# Altium schematic sheet byggern-schematic.SchDoc
size A3
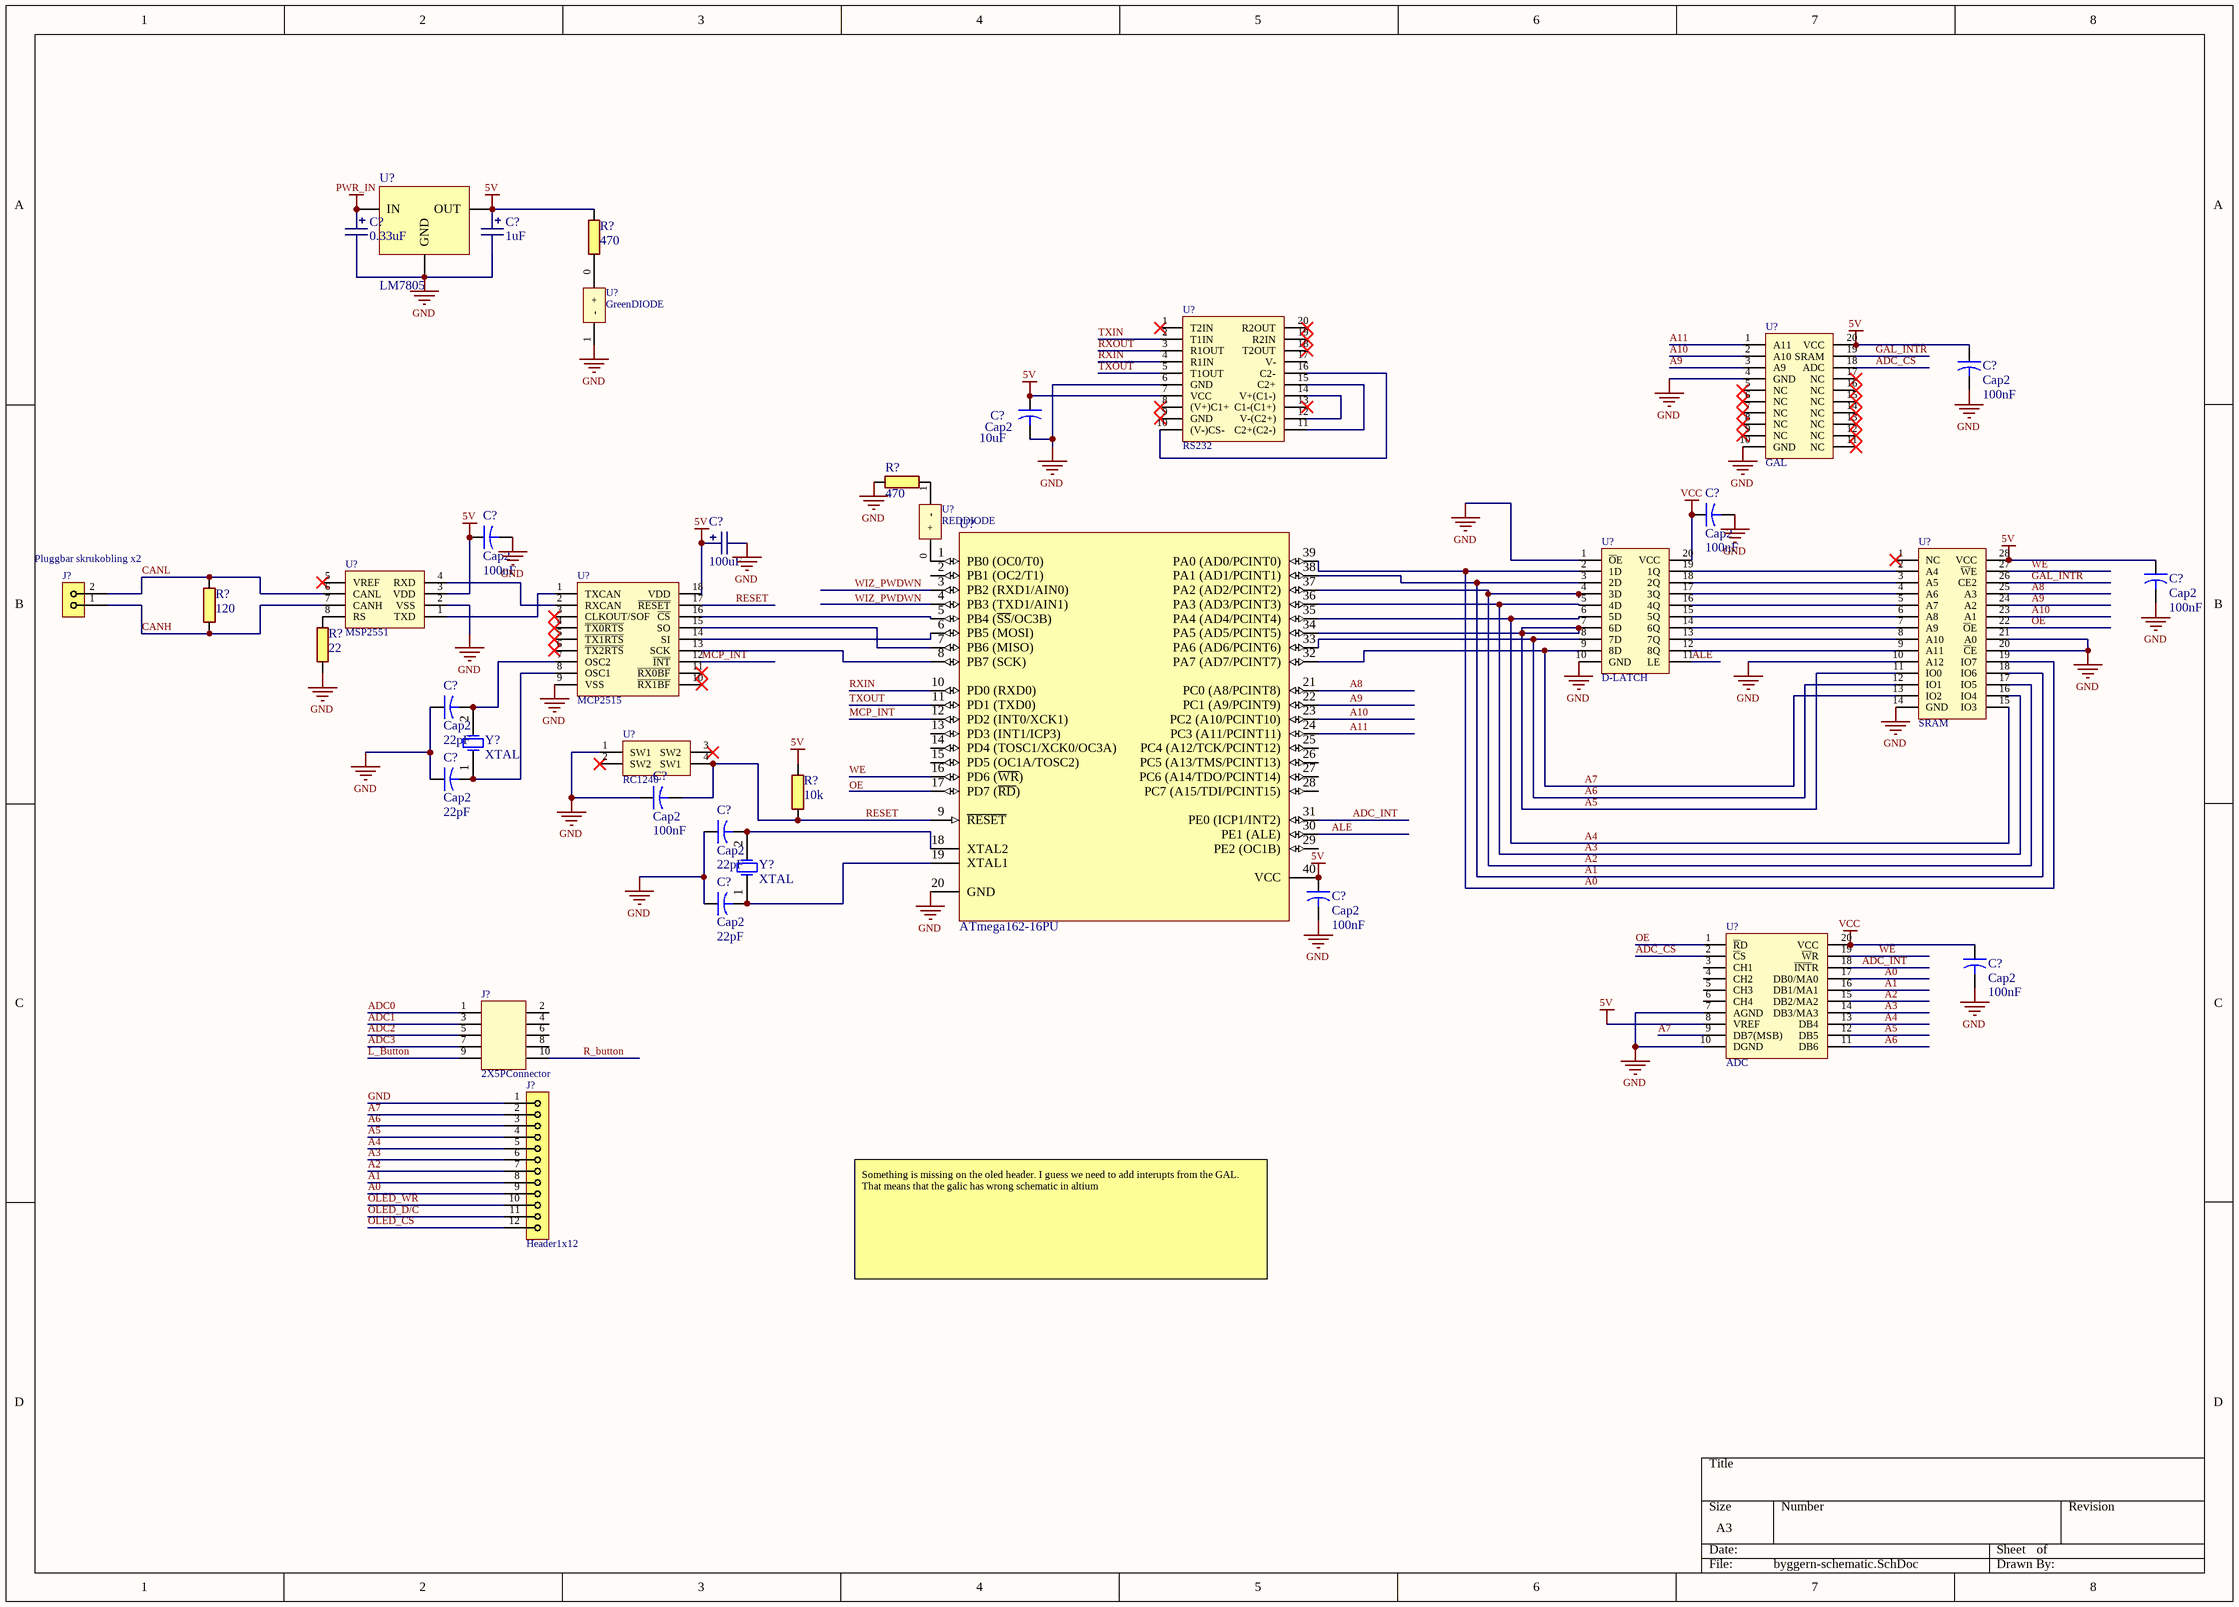
[diagram p0: byggern-schematic.SchDoc]

## Parts
(Parts that share a designator on the sheet are numbered #1, #2 ... from top to bottom, then left to right.)
C?#1  0.33uF  [CAPPR35D08H11]
C?#2  1uF  [CAPPR35D08H11]
C?#3  Cap2  value 100nF  [CAPR5-4X5]
C?#4  Cap2  value 10uF  [CAPR5-4X5]
C?#5  Cap2  value 100nF  [CAPR5-4X5]
C?#6  Cap2  value 100nF  [CAPR5-4X5]
C?#7  100uF  [CAPPR35D08H11]
C?#8  Cap2  value 100nF  [CAPR5-4X5]
C?#9  Cap2  value 22pF  [CAPR5-4X5]
C?#10  Cap2  value 22pF  [CAPR5-4X5]
C?#11  Cap2  value 100nF  [CAPR5-4X5]
C?#12  Cap2  value 22pF  [CAPR5-4X5]
C?#13  Cap2  value 22pF  [CAPR5-4X5]
C?#14  Cap2  value 100nF  [CAPR5-4X5]
C?#15  Cap2  value 100nF  [CAPR5-4X5]
J?#1  Pluggbar skrukobling x2  [FCI-20020110-C021A01LF]
J?#2  2X5PConnector  [HDRV10W64P254_2X5_2030X900X900B]
J?#3  Header1x12  [HDRV12W64P254_1X12_3048X254X900B]
R?#1  470  [RESA_0.25W]
R?#2  470  [RESA_0.25W]
R?#3  120  [RESA_0.25W]
R?#4  22  [RESA_0.25W]
R?#5  10k  [RESA_0.25W]
U?#1  LM7805  [TO-220-3P]
U?#2  GreenDIODE  [LGA30S127P7X81270X2540X350]
U?#3  RS232  [DIP20]
U?#4  GAL  [DIP20]
U?#5  REDDIODE  [LGA30S127P7X81270X2540X350]
U?#6  ATmega162-16PU  [40P6]
U?#7  MSP2551  [DIP8]
U?#8  D-LATCH  [DIP20]
U?#9  MCP2515  [DIP18]
U?#10  SRAM  [DIP28]
U?#11  RC1240  [LGA30S127P7X81270X2540X350]
U?#12  ADC  [DIP20]
Y?#1  XTAL  [R38]
Y?#2  XTAL  [R38]

## Nets
2: U?#1.4
5V: C?#2.2 C?#3.1 C?#4.1 C?#6.1 C?#7.2 C?#8.1 C?#14.1 R?#1.2 R?#5.2 U?#1.3(OUT) U?#3.7(VCC) U?#4.20(VCC) U?#6.40(VCC) U?#7.3(VDD) U?#9.18(VDD) U?#10.28(VCC) U?#12.8(VREF)
GND: C?#1.1 C?#2.1 C?#3.2 C?#4.2 C?#5.2 C?#6.2 C?#7.1 C?#8.2 C?#9.1 C?#10.1 C?#11.1 C?#12.1 C?#13.1 C?#14.2 C?#15.2 J?#3.1 R?#2.2 R?#4.1 U?#1.2(GND) U?#2.1(-) U?#3.6(GND) U?#4.4(GND) U?#4.10(GND) U?#6.20(GND) U?#7.2(VSS) U?#8.1(~{O}E) U?#8.10(GND) U?#9.9(VSS) U?#10.10(A12) U?#10.14(GND) U?#10.20(~{C}E) U?#10.21(A0) U?#11.1(SW1) U?#12.7(AGND) U?#12.10(DGND)
PWR_IN: C?#1.2 U?#1.1(IN)
VCC: C?#5.1 C?#15.1 U?#8.20(VCC) U?#12.20(VCC)
A0: J?#3.9 U?#6.39(PA0_(AD0/PCINT0)) U?#8.2(1D) U?#10.19(IO7) U?#12.17(DB0/MA0)
A1: J?#3.8 U?#6.38(PA1_(AD1/PCINT1)) U?#8.3(2D) U?#10.18(IO6) U?#12.16(DB1/MA1)
A2: J?#3.7 U?#6.37(PA2_(AD2/PCINT2)) U?#8.4(3D) U?#10.17(IO5) U?#12.15(DB2/MA2)
A3: J?#3.6 U?#6.36(PA3_(AD3/PCINT3)) U?#8.5(4D) U?#10.16(IO4) U?#12.14(DB3/MA3)
A4: J?#3.5 U?#6.35(PA4_(AD4/PCINT4)) U?#8.6(5D) U?#10.15(IO3) U?#12.13(DB4)
A5: J?#3.4 U?#6.34(PA5_(AD5/PCINT5)) U?#8.7(6D) U?#10.11(IO0) U?#12.12(DB5)
A6: J?#3.3 U?#6.33(PA6_(AD6/PCINT6)) U?#8.8(7D) U?#10.12(IO1) U?#12.11(DB6)
A7: J?#3.2 U?#6.32(PA7_(AD7/PCINT7)) U?#8.9(8D) U?#10.13(IO2) U?#12.9(DB7(MSB))
A8: U?#6.21(PC0_(A8/PCINT8)) U?#10.25(A3)
A9: U?#4.3(A9) U?#6.22(PC1_(A9/PCINT9)) U?#10.24(A2)
A10: U?#4.2(A10) U?#6.23(PC2_(A10/PCINT10)) U?#10.23(A1)
A11: U?#4.1(A11) U?#6.24(PC3_(A11/PCINT11))
ADC0: J?#2.1
ADC1: J?#2.3
ADC2: J?#2.5
ADC3: J?#2.7
ADC_CS: U?#4.18(ADC) U?#12.2(~{C}S)
ADC_INT: U?#6.31(PE0_(ICP1/INT2)) U?#12.18(~{INT}R)
ALE: U?#6.30(PE1_(ALE)) U?#8.11(LE)
CANH: J?#1.1 R?#3.1 U?#7.7(CANH)
CANL: J?#1.2 R?#3.2 U?#7.6(CANL)
GAL_INTR: U?#4.19(SRAM) U?#10.26(CE2)
L_Button: J?#2.9
MCP_INT: U?#6.12(PD2_(INT0/XCK1)) U?#9.12(~{INT})
OE: U?#10.22(~{O}E) U?#12.1(~{R}D)
OLED_CS: J?#3.12
OLED_D/C: J?#3.11
OLED_WR: J?#3.10
R_button: J?#2.10
RESET: C?#11.2 R?#5.1 U?#6.9(~{RESET}) U?#9.17(~{RESET}) U?#11.4(SW1)
RXIN: U?#3.4(R1IN) U?#6.10(PD0_(RXD0))
RXOUT: U?#3.3(R1OUT)
TXIN: U?#3.2(T1IN)
TXOUT: U?#3.5(T1OUT) U?#6.11(PD1_(TXD0))
WE: U?#6.16(PD6_(~{WR})) U?#10.27(~{W}E) U?#12.19(~{W}R)
WIZ_PWDWN: U?#6.3(PB2_(RXD1/AIN0))
NetC?#9_2: C?#9.2 U?#9.7(OSC2) Y?#1.2(OSC2)
NetC?#10_2: C?#10.2 U?#9.8(OSC1) Y?#1.1(OSC1)
NetC?#12_2: C?#12.2 U?#6.18(XTAL2) Y?#2.2(OSC2)
NetC?#13_2: C?#13.2 U?#6.19(XTAL1) Y?#2.1(OSC1)
NetR?#1_1: R?#1.1 U?#2.0(+)
NetR?#2_1: R?#2.1 U?#5.1(-)
NetR?#4_2: R?#4.2 U?#7.8(RS)
NetU?#3_10: U?#3.10((V-)CS-) U?#3.16(C2-)
NetU?#3_11: U?#3.11(C2+(C2-)) U?#3.15(C2+)
NetU?#3_12: U?#3.12(V-(C2+)) U?#3.14(V+(C1-))
NetU?#5_0: U?#5.0(+) U?#6.1(PB0_(OC0/T0))
NetU?#6_5: U?#6.5(PB4_(~{SS}/OC3B)) U?#9.16(~{CS})
NetU?#6_6: U?#6.6(PB5_(MOSI)) U?#9.14(SI)
NetU?#6_7: U?#6.7(PB6_(MISO)) U?#9.15(SO)
NetU?#6_8: U?#6.8(PB7_(SCK)) U?#9.13(SCK)
NetU?#7_1: U?#7.1(TXD) U?#9.1(TXCAN)
NetU?#7_4: U?#7.4(RXD) U?#9.2(RXCAN)
NetU?#8_12: U?#8.12(8Q) U?#10.9(A11)
NetU?#8_13: U?#8.13(7Q) U?#10.8(A10)
NetU?#8_14: U?#8.14(6Q) U?#10.7(A9)
NetU?#8_15: U?#8.15(5Q) U?#10.6(A8)
NetU?#8_16: U?#8.16(4Q) U?#10.5(A7)
NetU?#8_17: U?#8.17(3Q) U?#10.4(A6)
NetU?#8_18: U?#8.18(2Q) U?#10.3(A5)
NetU?#8_19: U?#8.19(1Q) U?#10.2(A4)

Not connected (* = marked no-connect by the designer): J?#2 2 4 6 8; U?#3 1(T2IN)* 8((V+)C1+)* 9(GND)* 13(C1-(C1+))* 17(V-) 18(T2OUT)* 19(R2IN)* 20(R2OUT)*; U?#4 5(NC)* 6(NC)* 7(NC)* 8(NC)* 9(NC)* 11(NC)* 12(NC)* 13(NC)* 14(NC)* 15(NC)* 16(NC)* 17(NC)*; U?#6 2(PB1_(OC2/T1)) 4(PB3_(TXD1/AIN1)) 13(PD3_(INT1/ICP3)) 14(PD4_(TOSC1/XCK0/OC3A)) 15(PD5_(OC1A/TOSC2)) 17(PD7_(~{RD})) 25(PC4_(A12/TCK/PCINT12)) 26(PC5_(A13/TMS/PCINT13)) 27(PC6_(A14/TDO/PCINT14)) 28(PC7_(A15/TDI/PCINT15)) 29(PE2_(OC1B)); U?#7 5(VREF)*; U?#9 3(CLKOUT/SOF)* 4(~{TX0RTS})* 5(~{TX1RTS})* 6(~{TX2RTS})* 10(~{RX1BF})* 11(~{RX0BF})*; U?#10 1(NC)*; U?#11 2(SW2)* 3(SW2)*; U?#12 3(CH1) 4(CH2) 5(CH3) 6(CH4)

## Notes on the sheet
- Something is missing on the oled header. I guess we need to add interupts from the GAL. That means that the galic has wrong schematic in altium
- Labels drawn without touching a wire or pin: OE, WIZ_PWDWN

## Library data of the parts
C?#1 C?#2 C?#7 = 3027: D=8mm Radial, 20% 50V 3,5mm pitch; id: 3027; pakke_opprettet_av: 815; leverandor_varenr: 1902932; pris: 2; nokkelord: Kondensator, Capacitor, CAP; produsent: Multikomp; leverandor: Farnell; pakketype: TH; pakke_opprettet: 25.02.2015 11:22:52; symbol_opprettet_av: 815; symbol_opprettet: 28.06.2014 15:26:13
  C?#1: navn: 0.33uF
  C?#2: navn: 1uF
  C?#7: navn: 100uF
C?#3-C?#6 C?#8-C?#15 = Cap2: Capacitor; Published: 23-Sep-2002; PackageReference: CAPR5-4X5; Publisher: Altium Limited; PackageDescription: Capacitor; 2 Leads
J?#1 = 2218: Skruplint; id: 2218; pakke_opprettet_av: 815; leverandor_varenr: 1787816; pris: 3; produsent: FCI; leverandor: Farnell; pakketype: TH; pakke_opprettet: 13.11.2014 14:07:06; symbol_opprettet_av: 815; symbol_opprettet: 13.11.2014 10:58:53; navn: Pluggbar skrukobling x2
J?#2 = 2391: Header; id: 2391; pakke_opprettet_av: 815; navn: Header Shrouded 2X5P; pris: 5; pakketype: TH; pakke_opprettet: 12.07.2014 17:42:52; symbol_opprettet_av: 815; symbol_opprettet: 12.07.2014 17:43:40; nokkelord: Header
J?#3 = 2439: 2,54mm pitch; id: 2439; pakke_opprettet_av: 815; pris: 6; pakketype: TH; pakke_opprettet: 13.11.2014 12:33:10; symbol_opprettet_av: 815; symbol_opprettet: 13.11.2014 11:01:39; navn: Header 1x12
R?#1 R?#2 = 2799: 0.25W 1% Generic resistor; id: 2799; rad: 4; rom: OV; lager_type: Fremlager; dybde: 0; hylle: 8; antall: 100; kolonne: 1; pakke_opprettet_av: 815; nokkelord: Motstand, Resistor; pakketype: TH; pakke_opprettet: 28.06.2014 17:13:33; symbol_opprettet_av: 815; symbol_opprettet: 08.07.2014 21:16:33; navn: 470; pris: 0
R?#3 = 2785: 0.25W 1% Generic resistor; id: 2785; rad: 3; rom: OV; lager_type: Fremlager; dybde: 2; hylle: 8; antall: 100; kolonne: 0; pakke_opprettet_av: 815; nokkelord: Motstand, Resistor; pakketype: TH; pakke_opprettet: 28.06.2014 17:13:33; symbol_opprettet_av: 815; symbol_opprettet: 08.07.2014 21:16:33; navn: 120; pris: 0
R?#4 = 2767: 0.25W 1% Generic resistor; id: 2767; rad: 1; rom: OV; lager_type: Fremlager; dybde: 0; hylle: 8; antall: 100; kolonne: 2; pakke_opprettet_av: 815; nokkelord: Motstand, Resistor; pakketype: TH; pakke_opprettet: 28.06.2014 17:13:33; symbol_opprettet_av: 815; symbol_opprettet: 08.07.2014 21:16:33; navn: 22; pris: 0
R?#5 = 2831: 0.25W 1% Generic resistor; id: 2831; rad: 7; rom: OV; lager_type: Fremlager; dybde: 0; hylle: 8; antall: 100; pakke_opprettet_av: 815; nokkelord: Motstand, Resistor; pakketype: TH; kolonne: 0; pakke_opprettet: 28.06.2014 17:13:33; symbol_opprettet_av: 815; symbol_opprettet: 08.07.2014 21:16:33; navn: 10k; pris: 0
U?#1 = 1433: Voltage Regulator; id: 1433; rad: 0; rom: OV; lager_type: Fremlager; hylle: 9; antall: 40; pakke_opprettet_av: 815; leverandor_varenr: 152-3798; pris: 8; produsent: Fairchild; leverandor: Farnell; pakketype: TH; dybde: 0; kolonne: 0; pakke_opprettet: 09.06.2015 21:08:41; symbol_opprettet_av: 815; symbol_opprettet: 20.06.2015 13:45:33; navn: LM7805
U?#2 U?#5 = Diode: Narrow Band Multi-Channel RF Transceiver Module; navn: RC1240; rad: 4; rom: OV; lager_type: Fremlager; dybde: 0; hylle: 2; antall: 40; pakke_opprettet_av: 809; pris: 10; pakketype: 21; produsent: Radiocrafts; id: 2359; kolonne: 4; pakke_opprettet: 21.06.2014 17:19:32; symbol_opprettet_av: 809; symbol_opprettet: 21.06.2014 17:13:48; nokkelord: Narrow Band Multi-Channel RF Transceiver Module
U?#3 = Maxim-RS232: Narrow Band Multi-Channel RF Transceiver Module; navn: RC1240; rad: 4; rom: OV; lager_type: Fremlager; dybde: 0; hylle: 2; antall: 40; pakke_opprettet_av: 809; pris: 10; pakketype: 21; produsent: Radiocrafts; id: 2359; kolonne: 4; pakke_opprettet: 21.06.2014 17:19:32; symbol_opprettet_av: 809; symbol_opprettet: 21.06.2014 17:13:48; nokkelord: Narrow Band Multi-Channel RF Transceiver Module
U?#4 = GAL16V8D-15QP: Narrow Band Multi-Channel RF Transceiver Module; navn: RC1240; rad: 4; rom: OV; lager_type: Fremlager; dybde: 0; hylle: 2; antall: 40; pakke_opprettet_av: 809; pris: 10; pakketype: 21; produsent: Radiocrafts; id: 2359; kolonne: 4; pakke_opprettet: 21.06.2014 17:19:32; symbol_opprettet_av: 809; symbol_opprettet: 21.06.2014 17:13:48; nokkelord: Narrow Band Multi-Channel RF Transceiver Module
U?#6 = ATmega162-16PU: 8-bit AVR Microcontroller, 16KB Flash, 512 Bytes EEPROM, 1KB SRAM, 40-pin PDIP, Industrial Grade (-40°C to 85°C); DatasheetVersion: revK, Jul-2009; PackageVersion: revB, Sep-2001; PackageReference: 40P6; PackageDescription: 40-lead (0.600"/15.24mm Wide) Plastic Dual Inline Package (PDIP); Code_JEDEC: MS-011-AC; PartNumber: ATmega162-16PU; ComponentLink1Description: Manufacturer URL; ComponentLink1URL: http://www.atmel.com/; ComponentLink2Description: ATmega162 (V)  Datasheet; ComponentLink2URL: http://www.atmel.com/dyn/resources/prod_documents/doc2513.pdf; ComponentLink3Description: ATmega162 (V) Summary; ComponentLink3URL: http://www.atmel.com/dyn/resources/prod_documents/2513S.pdf
U?#7 = MCP2551: Narrow Band Multi-Channel RF Transceiver Module; navn: RC1240; rad: 4; rom: OV; lager_type: Fremlager; dybde: 0; hylle: 2; antall: 40; pakke_opprettet_av: 809; pris: 10; pakketype: 21; produsent: Radiocrafts; id: 2359; kolonne: 4; pakke_opprettet: 21.06.2014 17:19:32; symbol_opprettet_av: 809; symbol_opprettet: 21.06.2014 17:13:48; nokkelord: Narrow Band Multi-Channel RF Transceiver Module
U?#8 = D-LATCH_SN54ALS673: Narrow Band Multi-Channel RF Transceiver Module; navn: RC1240; rad: 4; rom: OV; lager_type: Fremlager; dybde: 0; hylle: 2; antall: 40; pakke_opprettet_av: 809; pris: 10; pakketype: 21; produsent: Radiocrafts; id: 2359; kolonne: 4; pakke_opprettet: 21.06.2014 17:19:32; symbol_opprettet_av: 809; symbol_opprettet: 21.06.2014 17:13:48; nokkelord: Narrow Band Multi-Channel RF Transceiver Module
U?#9 = MCP2515: Narrow Band Multi-Channel RF Transceiver Module; navn: RC1240; rad: 4; rom: OV; lager_type: Fremlager; dybde: 0; hylle: 2; antall: 40; pakke_opprettet_av: 809; pris: 10; pakketype: 21; produsent: Radiocrafts; id: 2359; kolonne: 4; pakke_opprettet: 21.06.2014 17:19:32; symbol_opprettet_av: 809; symbol_opprettet: 21.06.2014 17:13:48; nokkelord: Narrow Band Multi-Channel RF Transceiver Module
U?#10 = SRAM-CY7C185: Narrow Band Multi-Channel RF Transceiver Module; navn: RC1240; rad: 4; rom: OV; lager_type: Fremlager; dybde: 0; hylle: 2; antall: 40; pakke_opprettet_av: 809; pris: 10; pakketype: 21; produsent: Radiocrafts; id: 2359; kolonne: 4; pakke_opprettet: 21.06.2014 17:19:32; symbol_opprettet_av: 809; symbol_opprettet: 21.06.2014 17:13:48; nokkelord: Narrow Band Multi-Channel RF Transceiver Module
U?#11 = SW: Narrow Band Multi-Channel RF Transceiver Module; rad: 4; rom: OV; lager_type: Fremlager; dybde: 0; hylle: 2; antall: 40; pakke_opprettet_av: 809; pris: 10; pakketype: 21; produsent: Radiocrafts; id: 2359; navn: RC1240; kolonne: 4; pakke_opprettet: 21.06.2014 17:19:32; symbol_opprettet_av: 809; symbol_opprettet: 21.06.2014 17:13:48; nokkelord: Narrow Band Multi-Channel RF Transceiver Module
U?#12 = ADC0844CNN: Narrow Band Multi-Channel RF Transceiver Module; navn: RC1240; rad: 4; rom: OV; lager_type: Fremlager; dybde: 0; hylle: 2; antall: 40; pakke_opprettet_av: 809; pris: 10; pakketype: 21; produsent: Radiocrafts; id: 2359; kolonne: 4; pakke_opprettet: 21.06.2014 17:19:32; symbol_opprettet_av: 809; symbol_opprettet: 21.06.2014 17:13:48; nokkelord: Narrow Band Multi-Channel RF Transceiver Module
Y?#1 Y?#2 = XTAL: Crystal Oscillator; Published: 8-Jun-2000; LatestRevisionDate: 17-Jul-2002; LatestRevisionNote: Re-released for DXP Platform.; PackageReference: R38; Publisher: Altium Limited; PackageDescription: Crystal, Thru-Hole; 2 Leads; Body 3.1 x 8.2 mm (Dia.xH)